# EAGLE design LEDCube (EAGLE 7.2.0)
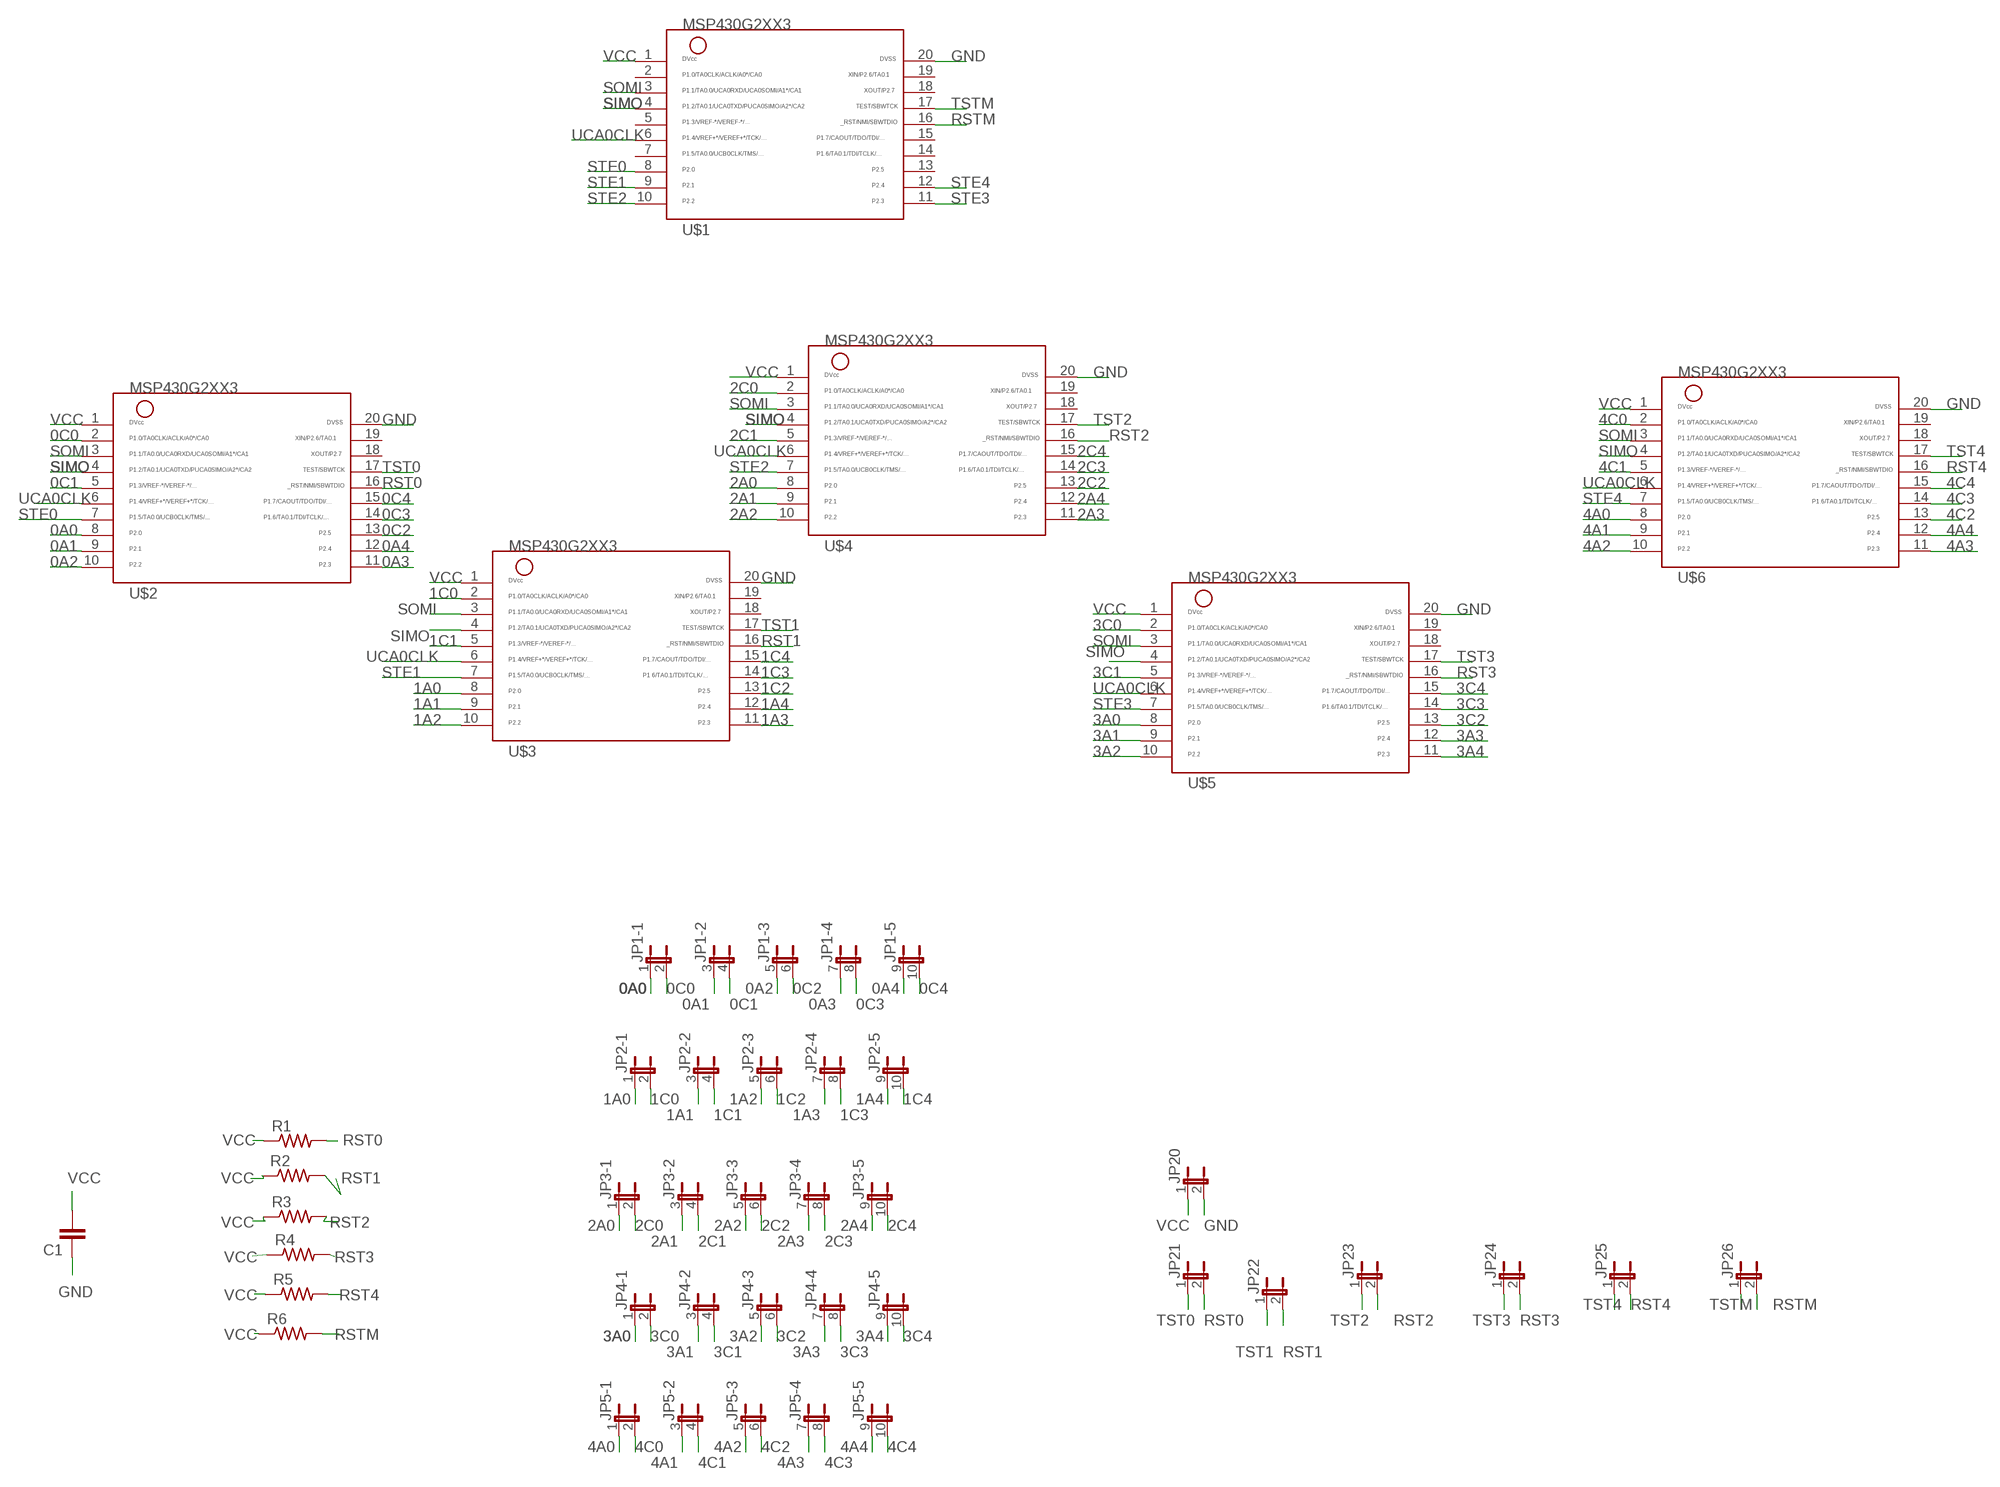
[diagram p0: schematic, sheet 1]

## Parts
C1  CC1206  [C1206]
JP1  JP5QE  [JP5Q]
JP2  JP5QE  [JP5Q]
JP3  JP5QE  [JP5Q]
JP4  JP5QE  [JP5Q]
JP5  JP5QE  [JP5Q]
JP20  JP1E  [JP1]
JP21  JP1E  [JP1]
JP22  JP1E  [JP1]
JP23  JP1E  [JP1]
JP24  JP1E  [JP1]
JP25  JP1E  [JP1]
JP26  JP1E  [JP1]
R1  R-US_R1206  [R1206]
R2  R-US_R1206  [R1206]
R3  R-US_R1206  [R1206]
R4  R-US_R1206  [R1206]
R5  R-US_R1206  [R1206]
R6  R-US_R1206  [R1206]
U$1  MSP430G2XX3TSSOP  [PW20]
U$2  MSP430G2XX3TSSOP  [PW20]
U$3  MSP430G2XX3TSSOP  [PW20]
U$4  MSP430G2XX3TSSOP  [PW20]
U$5  MSP430G2XX3TSSOP  [PW20]
U$6  MSP430G2XX3TSSOP  [PW20]

## Nets
0A0: JP1.1 U$2.8
0A1: JP1.3 U$2.9
0A2: JP1.5 U$2.10
0A3: JP1.7 U$2.11
0A4: JP1.9 U$2.12
0C0: JP1.2 U$2.2
0C1: JP1.4 U$2.5
0C2: JP1.6 U$2.13
0C3: JP1.8 U$2.14
0C4: JP1.10 U$2.15
1A0: JP2.1 U$3.8
1A1: JP2.3 U$3.9
1A2: JP2.5 U$3.10
1A3: JP2.7 U$3.11
1A4: JP2.9 U$3.12
1C0: JP2.2 U$3.2
1C1: JP2.4 U$3.5
1C2: JP2.6 U$3.13
1C3: JP2.8 U$3.14
1C4: JP2.10 U$3.15
2A0: JP3.1 U$4.8
2A1: JP3.3 U$4.9
2A2: JP3.5 U$4.10
2A3: JP3.7 U$4.11
2A4: JP3.9 U$4.12
2C0: JP3.2 U$4.2
2C1: JP3.4 U$4.5
2C2: JP3.6 U$4.13
2C3: JP3.8 U$4.14
2C4: JP3.10 U$4.15
3A0: JP4.1 U$5.8
3A1: JP4.3 U$5.9
3A2: JP4.5 U$5.10
3A3: JP4.7 U$5.12
3A4: JP4.9 U$5.11
3C0: JP4.2 U$5.2
3C1: JP4.4 U$5.5
3C2: JP4.6 U$5.13
3C3: JP4.8 U$5.14
3C4: JP4.10 U$5.15
4A0: JP5.1 U$6.8
4A1: JP5.3 U$6.9
4A2: JP5.5 U$6.10
4A3: JP5.7 U$6.11
4A4: JP5.9 U$6.12
4C0: JP5.2 U$6.2
4C1: JP5.4 U$6.5
4C2: JP5.6 U$6.13
4C3: JP5.8 U$6.14
4C4: JP5.10 U$6.15
GND: C1.1 JP20.2 U$1.20 U$2.20 U$3.20 U$4.20 U$5.20 U$6.20
RST0: JP21.2 R1.2 U$2.16
RST1: JP22.2 R2.2 U$3.16
RST2: JP23.2 R3.2 U$4.16
RST3: JP24.2 R4.2 U$5.16
RST4: JP25.2 R5.2 U$6.16
RSTM: JP26.2 R6.2 U$1.16
SIMO: U$1.4 U$2.4 U$3.4 U$4.4 U$5.4 U$6.4
SOMI: U$1.3 U$2.3 U$3.3 U$4.3 U$5.3 U$6.3
STE0: U$1.8 U$2.7
STE1: U$1.9 U$3.7
STE2: U$1.10 U$4.7
STE3: U$1.11 U$5.7
STE4: U$1.12 U$6.7
TST0: JP21.1 U$2.17
TST1: JP22.1 U$3.17
TST2: JP23.1 U$4.17
TST3: JP24.1 U$5.17
TST4: JP25.1 U$6.17
TSTM: JP26.1 U$1.17
UCA0CLK: U$1.6 U$2.6 U$3.6 U$4.6 U$5.6 U$6.6
VCC: C1.2 JP20.1 R1.1 R2.1 R3.1 R4.1 R5.1 R6.1 U$1.1 U$2.1 U$3.1 U$4.1 U$5.1 U$6.1
Unconnected: U$1.2 U$1.5 U$1.7 U$1.13 U$1.14 U$1.15 U$1.18 U$1.19 U$2.18 U$2.19 U$3.18 U$3.19 U$4.18 U$4.19 U$5.18 U$5.19 U$6.18 U$6.19

## Library data of the parts
C1 = eagle-ltspice:C: CAPACITOR, European symbol; SPICEMODEL: NONE; SPICEPREFIX: C
JP1-JP5 = jumper:JP5QE: JUMPER
JP20-JP26 = jumper:JP1E: JUMPER
R1-R6 = rcl:R-US_: RESISTOR, American symbol
U$1-U$6 = ELEC327:MSP430G2XX3: MSP430G2XX3 PDIP (N) 20 Pin Package

## Board
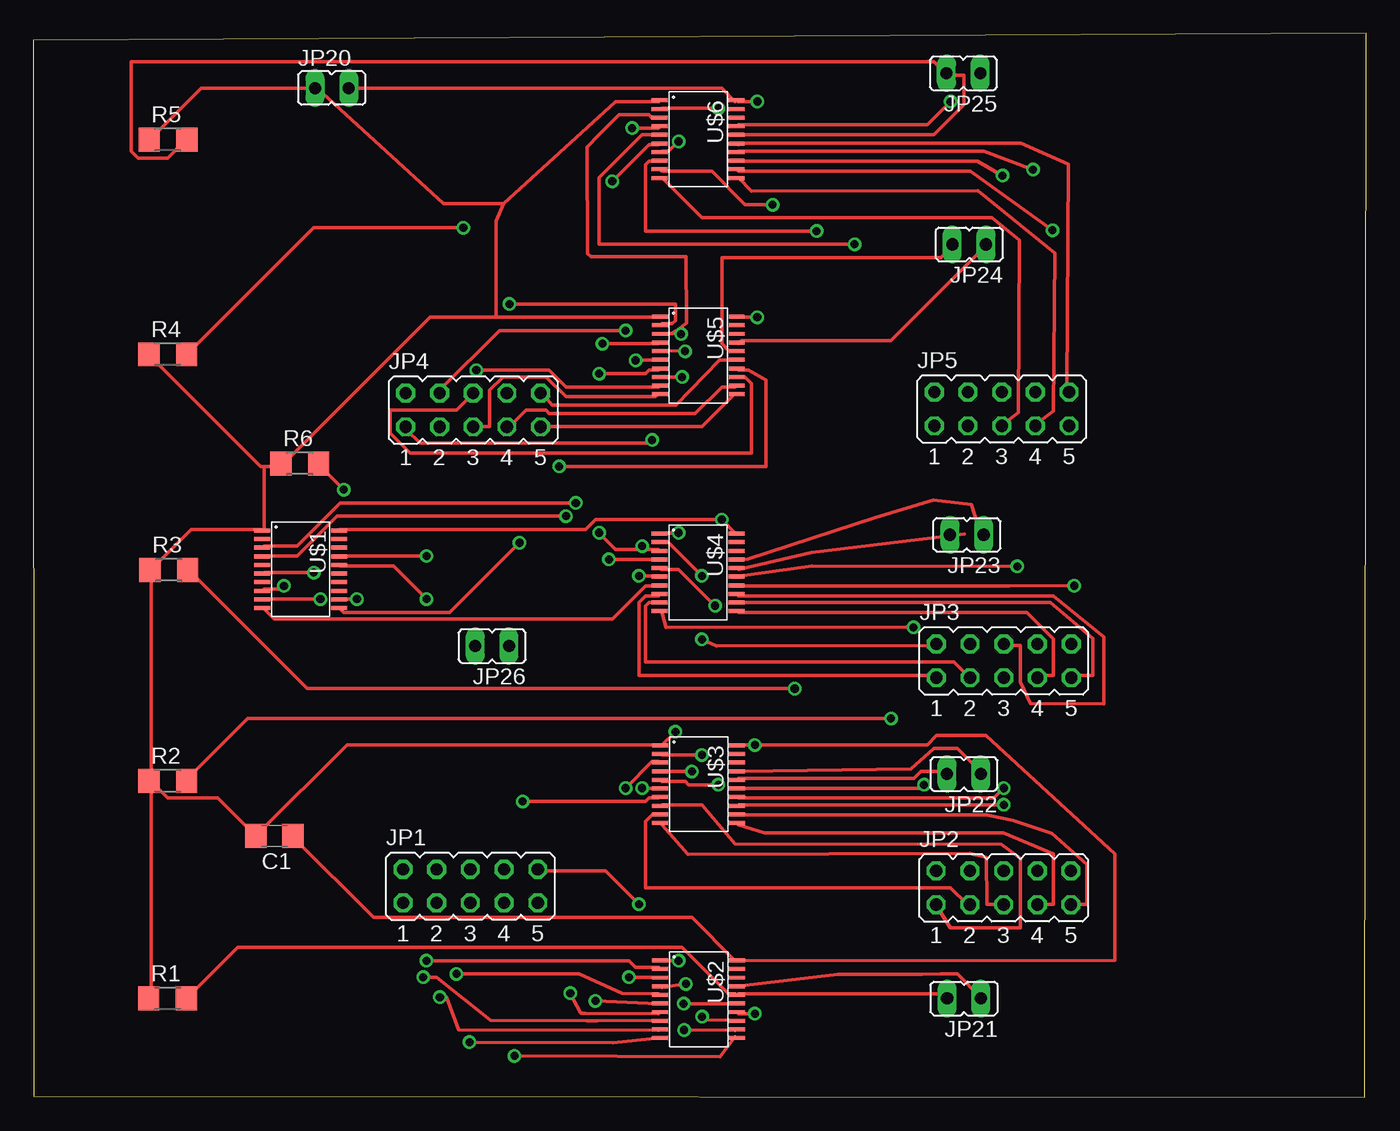
[diagram p1: board, top side]
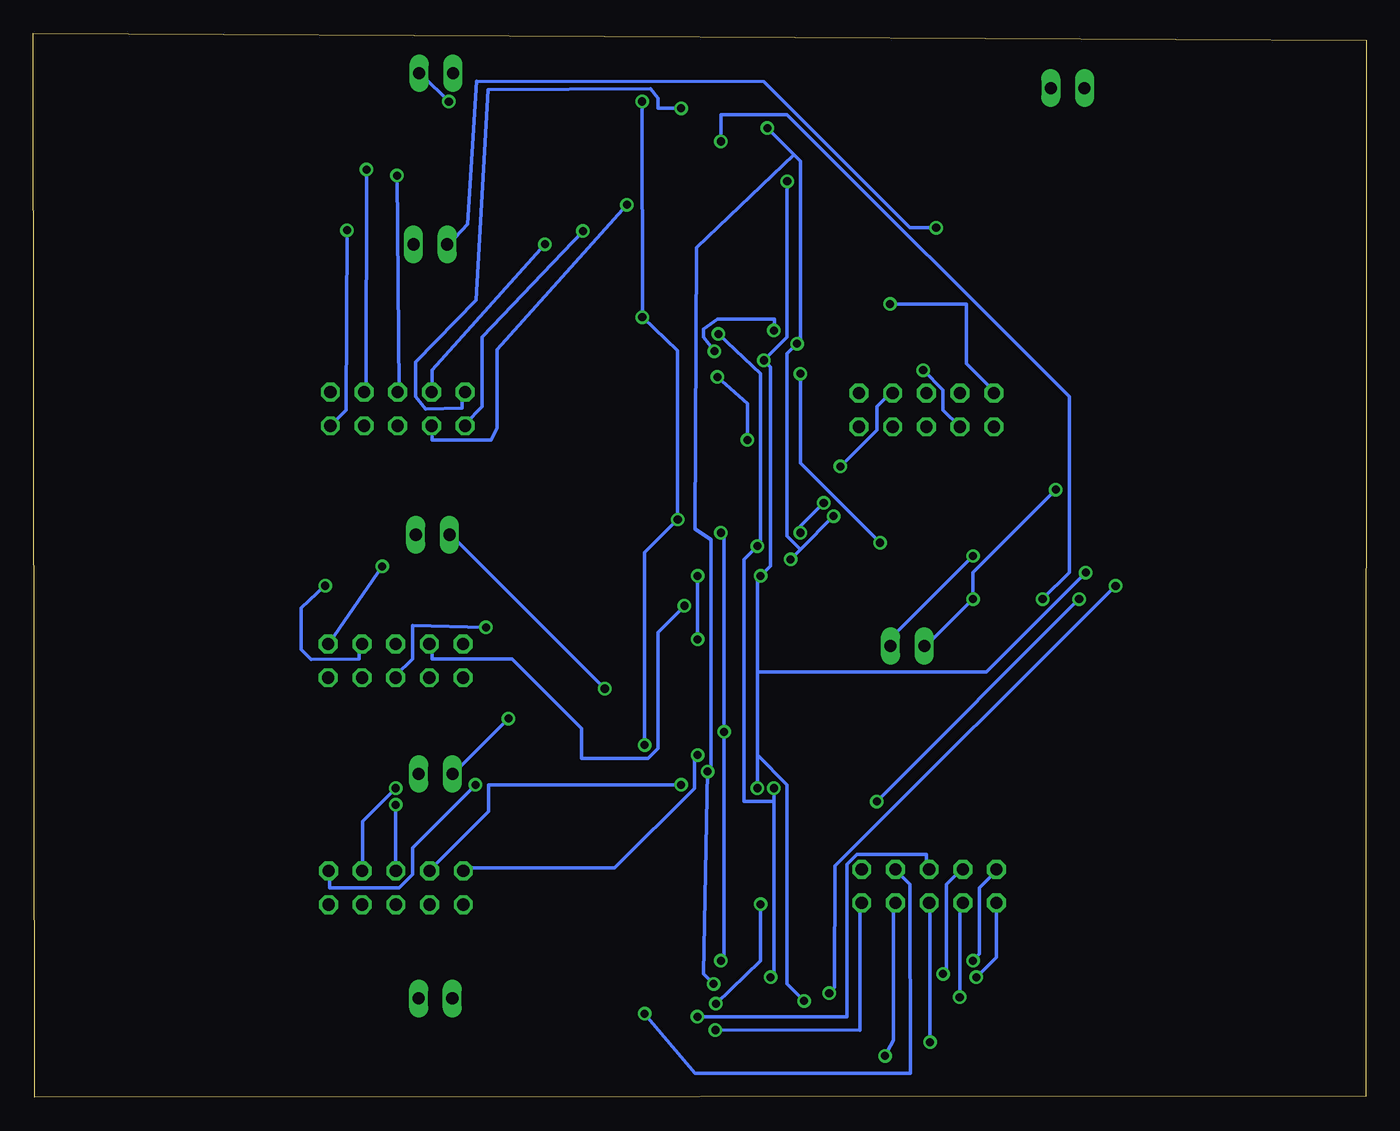
[diagram p2: board, bottom side, seen from below]

Size 100.48 x 80.22 mm. Coordinates in mm from the lower left corner, seen from the top.
Outline: 0.05,0.08 100.37,0 100.48,80.22 0,79.68 0.05,0.08
Copper layers (1*16): Top 0.035mm / dielectric 1.5mm / Bottom 0.035mm
Design rules "default": minimum track width 10mil, minimum drill 24mil, track to track 8mil, track to pad 8mil, pad to pad 8mil, via to via 8mil, smd to smd 8mil, copper to edge 40mil, drill to drill 8mil, minimum pad ring 10mil, minimum via ring 8mil, stop-mask expansion 4mil, vias tented up to drill 0mil, thermal gap 10mil

### Footprints (pad centres in the part's own frame; a part is rotated, then mirrored left to right if it is on the bottom)
C1206 = smd 1.6 x 1.8: 1 -1.4,0; 2 1.4,0
JP5Q = drill 0.914 octagon: 1 -5.08,-1.27; 2 -5.08,1.27; 3 -2.54,-1.27; 4 -2.54,1.27; 5 0,-1.27; 6 0,1.27; 7 2.54,-1.27; 8 2.54,1.27; 9 5.08,-1.27; 10 5.08,1.27
JP1 = drill 0.914 long: 1 0,-1.27; 2 0,1.27
R1206 = smd 1.6 x 1.803: 1 -1.422,0; 2 1.422,0
PW20 = smd 0.3 x 1.2: 1 -2.925,-2.9; 2 -2.275,-2.9; 3 -1.625,-2.9; 4 -0.975,-2.9; 5 -0.325,-2.9; 6 0.325,-2.9; 7 0.975,-2.9; 8 1.625,-2.9; 9 2.275,-2.9; 10 2.925,-2.9; 11 2.925,2.9; 12 2.275,2.9; 13 1.625,2.9; 14 0.975,2.9; 15 0.325,2.9; 16 -0.325,2.9; 17 -0.975,2.9; 18 -1.625,2.9; 19 -2.275,2.9; 20 -2.925,2.9

### Placement (x,y rotation side)
C1  18.18,19.72 180 top
JP1  32.95,15.93 0 top
JP2  73.14,15.8 0 top
JP3  73.16,32.91 0 top
JP4  33.16,51.82 0 top
JP5  73,51.89 0 top
JP20  22.51,76.08 270 top
JP21  70.16,7.46 90 top
JP22  70.15,24.39 90 top
JP23  70.37,42.41 90 top
JP24  70.55,64.3 90 top
JP25  70.11,77.2 90 top
JP26  34.59,34.03 90 top
R1  10.13,7.46 0 top
R2  10.14,23.86 0 top
R3  10.23,39.77 0 top
R4  10.15,56.01 0 top
R5  10.16,72.2 0 top
R6  20.1,47.79 0 top
U$1  20.16,39.81 270 top
U$2  50.15,7.41 270 top
U$3  50.15,23.61 270 top
U$4  50.11,39.58 270 top
U$5  50.13,55.93 270 top
U$6  50.12,72.23 270 top

### Tracks (layer width: path | path; a pad name or v marks a point on that pad's centre or on a via)
0A0  (via drill 0.61)
  Top 0.254: v29.4,9.06 30.4,9.06 34.49,5.83 41.69,5.76 42.52,5.76 47.15,5.81 U$2.8
  Bottom 0.254: v29.4,9.06 27.9,10.56 27.9,14.56 JP1.1
0A1  (via drill 0.61)
  Top 0.254: v30.65,7.56 31.15,7.56 32.05,5.08 47.15,5.06 U$2.9
  Bottom 0.254: v30.65,7.56 30.65,14.56 JP1.3
0A2  (via drill 0.61)
  Top 0.254: v32.88,4.16 43.71,4.13 U$2.10
  Bottom 0.254: v32.88,4.16 32.9,14.56 JP1.5
0A3  (via drill 0.61)
  Top 0.254: v36.27,3.13 51.76,3.06 52.9,4.56 U$2.11
  Bottom 0.254: v36.27,3.13 35.65,4.31 35.65,14.56 JP1.7
0A4  (via drill 0.61)
  Top 0.254: v49.06,5.08 52.9,5.06 U$2.12
  Bottom 0.254: v49.06,5.08 38.15,5.06 38.15,14.56 JP1.9
0C0  (via drill 0.61)
  Top 0.254: v29.65,10.31 44.9,10.31 45.4,9.81 47.15,9.81 U$2.2
  Bottom 0.254: v29.65,10.31 29.15,10.81 29.15,15.81 27.9,17.06 JP1.2
0C1  (via drill 0.61)
  Top 0.254: v31.9,9.31 41.15,9.31 44.37,7.86 47.15,7.81 U$2.5
  Bottom 0.254: v31.9,9.31 31.65,9.56 31.65,16.06 30.65,17.06 JP1.4
0C2  (via drill 0.61)
  Top 0.254: v50.42,6.09 50.9,5.85 52.9,5.81 U$2.13
  Bottom 0.254: v50.42,6.09 39.15,6.06 39.15,17.56 38.4,18.31 33.15,18.31 33.15,17.31 JP1.6
0C3  (via drill 0.61)
  Top 0.254: v54.4,6.31 53.15,6.31 U$2.14
  Bottom 0.254: v54.4,6.31 50.61,1.83 34.36,1.83 34.4,16.06 35.4,17.06 JP1.8
0C4  (via drill 0.61)
  Top 0.254: v49.03,7.06 52.9,7.06 U$2.15 | v45.65,14.56 43.15,17.06 38.15,17.06 JP1.10
  Bottom 0.254: v49.03,7.06 45.65,10.31 v45.65,14.56
1A0
  Top 0.254: U$3.8 47.4,22.06 50.4,22.06 52.91,19.1 72.98,19.07 74.4,18.02 74.4,12.8 69.15,12.8 68.15,14.31 JP2.1
1A1
  Top 0.254: U$3.9 47.15,21.31 46.65,21.31 46.15,20.81 46.15,15.81 69.15,15.81 70.4,14.56 JP2.3
1A2
  Top 0.254: U$3.10 47.4,20.56 49.36,18.31 70.61,18.39 71.86,18.08 71.9,14.56 72.9,14.56 JP2.5
1A3
  Top 0.254: U$3.11 53.15,20.56 55.12,19.94 73.12,19.93 76.9,18.34 76.9,14.56 75.9,14.56 JP2.7
1A4
  Top 0.254: U$3.12 53.15,21.31 71.86,21.31 73.85,20.89 76.77,19.89 79.4,17.56 79.4,14.56 78.4,14.56 JP2.9
1C0  (via drill 0.61)
  Top 0.254: v50.4,25.81 47.4,25.81 U$3.2
  Bottom 0.254: v50.4,25.81 50.65,25.56 50.65,23.31 56.65,17.31 67.9,17.31 JP2.2
1C1  (via drill 0.61)
  Top 0.254: v51.65,23.56 49.4,23.56 49.15,23.81 47.4,23.81 U$3.5
  Bottom 0.254: v51.65,23.56 66.15,23.56 66.15,21.56 70.4,17.31 JP2.4
1C2  (via drill 0.61)
  Top 0.254: v73.15,22.06 53.15,22.06 U$3.13
  Bottom 0.254: v73.15,22.06 73.15,17.31 JP2.6
1C3  (via drill 0.61)
  Top 0.254: v73.15,23.31 72.4,22.56 53.15,22.56 U$3.14
  Bottom 0.254: v73.15,23.31 75.65,20.81 75.65,17.31 JP2.8
1C4  (via drill 0.61)
  Top 0.254: v67.15,23.56 66.9,23.31 53.15,23.31 U$3.15
  Bottom 0.254: v67.15,23.56 71.9,18.81 71.9,16.81 72.9,15.81 78.15,15.81 78.15,17.06 JP2.10
2A0
  Top 0.254: U$4.8 47.15,37.81 46.15,37.81 45.65,37.31 45.65,31.81 67.9,31.81 JP3.1
2A1
  Top 0.254: U$4.9 47.15,37.31 46.4,37.31 46.15,37.06 46.15,32.81 69.4,32.81 70.4,31.81 JP3.3
2A2  (via drill 0.61)
  Top 0.254: v66.35,35.43 65.82,35.46 47.7,35.41 47.4,36.56 U$4.10
  Bottom 0.254: v66.35,35.43 71.9,35.56 71.9,33.06 73.15,31.81 JP3.5
2A3
  Top 0.254: U$4.11 53.15,36.56 74.9,36.56 76.9,34.56 76.9,31.81 75.9,31.81 JP3.7
2A4
  Top 0.254: U$4.12 53.15,37.31 76.65,37.31 79.88,34.58 79.87,31.81 78.4,31.81 JP3.9
2C0  (via drill 0.61)
  Top 0.254: v50.4,39.31 47.9,41.81 47.4,41.81 U$4.2 | v50.4,34.53 51.49,34.02 67.51,34.05 JP3.2
  Bottom 0.254: v50.4,34.53 v50.4,39.31
2C1  (via drill 0.61)
  Top 0.254: v51.4,37.06 48.65,39.81 47.4,39.81 U$4.5
  Bottom 0.254: v51.4,37.06 53.4,35.06 53.4,26.31 54.15,25.56 59.15,25.56 59.15,27.81 64.4,33.06 70.4,33.06 70.4,34.06 JP3.4
2C2
  Top 0.254: U$4.13 53.15,37.81 76.9,37.81 80.69,34.72 80.69,29.67 75.15,29.69 74.4,31.31 74.4,34.06 73.4,34.06 JP3.6
2C3  (via drill 0.61)
  Top 0.254: v78.47,38.57 73.54,38.54 72.25,38.56 53.15,38.56 U$4.14
  Bottom 0.254: v78.47,38.57 80.29,36.88 80.29,33.76 79.54,33.01 75.9,33.06 75.9,34.06 JP3.8
2C4  (via drill 0.61)
  Top 0.254: v74.17,40.03 58.69,40.04 U$4.15
  Bottom 0.254: v74.17,40.03 78.15,34.31 JP3.10
3A0  (via drill 0.61)
  Top 0.254: v48.91,54.31 47.4,54.31 U$5.8 | v46.65,49.56 46.4,49.31 29.15,49.31 28.15,50.31 JP4.1
  Bottom 0.254: v48.91,54.31 46.65,52.31 v46.65,49.56
3A1  (via drill 0.61)
  Top 0.254: v33.4,54.81 38.9,54.81 40.15,53.56 47.15,53.56 U$5.9
  Bottom 0.254: v33.4,54.81 31.9,53.31 31.9,51.81 30.65,50.56 JP4.3
3A2
  Top 0.254: U$5.10 47.15,53.06 46.9,52.81 40.15,52.81 38.65,54.31 35.4,54.31 34.4,53.31 34.4,50.56 33.4,50.56 JP4.5
3A3
  Top 0.254: U$5.12 52.9,53.56 51.9,53.56 49.9,51.56 38.9,51.56 38.65,51.81 37.15,51.81 35.9,50.56 JP4.7
3A4
  Top 0.254: U$5.11 52.9,53.06 50.4,50.56 38.4,50.56 JP4.9
3C0  (via drill 0.61)
  Top 0.254: v35.9,59.81 48.4,59.81 48.4,58.56 48.15,58.31 47.4,58.31 U$5.2
  Bottom 0.254: v35.9,59.81 30.15,59.81 30.15,55.31 28.15,53.31 JP4.2
3C1  (via drill 0.61)
  Top 0.254: v49.14,56.25 47.4,56.31 U$5.5 | v44.65,57.81 35.15,57.81 30.65,53.31 JP4.4
  Bottom 0.254: v49.14,56.25 49.96,57.32 49.96,57.93 48.9,58.67 44.62,58.67 v44.65,57.81
3C2
  Top 0.254: U$5.13 53.15,54.31 53.65,54.31 54.15,53.81 54.15,48.56 28.4,48.56 26.9,50.06 26.9,51.81 31.9,51.81 33.15,53.06 JP4.6
3C3  (via drill 0.61)
  Top 0.254: v39.65,47.56 55.25,47.56 55.25,54.06 53.9,54.81 53.15,54.81 U$5.14
  Bottom 0.254: v39.65,47.56 36.9,50.31 36.9,52.06 35.9,53.06 JP4.8
3C4
  Top 0.254: U$5.15 52.9,55.56 51.74,55.57 48.45,52.2 39.11,52.19 38.4,53.06 JP4.10
4A0  (via drill 0.61)
  Top 0.254: v59.05,65.31 46.15,65.31 46.15,70.31 46.4,70.56 47.15,70.56 U$6.8
  Bottom 0.254: v59.05,65.31 66.65,57.31 66.65,52.06 67.9,50.81 JP5.1
4A1  (via drill 0.61)
  Top 0.254: v55.73,67.29 53.65,67.31 51.15,69.81 47.4,69.81 U$6.9
  Bottom 0.254: v55.73,67.29 65.52,56.36 65.52,50.46 65.98,49.56 70.4,49.56 70.4,50.56 JP5.3
4A2
  Top 0.254: U$6.10 47.4,69.31 50.4,66.31 72.27,66.31 74.32,64.61 74.27,51.63 73.15,50.81 JP5.5
4A3
  Top 0.254: U$6.11 53.15,69.31 54.15,68.31 71.19,68.35 76.99,63.64 76.88,51.72 75.65,50.81 JP5.7
4A4  (via drill 0.61)
  Top 0.254: v76.83,65.37 70.65,69.81 53.15,69.81 U$6.12
  Bottom 0.254: v76.83,65.37 76.9,51.81 77.9,50.81 JP5.9
4C0  (via drill 0.61)
  Top 0.254: v51.65,74.56 47.4,74.56 U$6.2
  Bottom 0.254: v51.65,74.56 53.4,74.56 53.4,75.31 53.94,76.02 66.2,75.95 67.09,60.09 71.67,55.41 71.65,52.81 70.9,51.88 68.15,51.95 68.15,53.06 JP5.2
4C1  (via drill 0.61)
  Top 0.254: v61.9,64.31 42.65,64.31 42.65,69.31 45.9,72.56 47.15,72.56 U$6.5
  Bottom 0.254: v61.9,64.31 70.4,54.81 70.4,53.31 JP5.4
4C2  (via drill 0.61)
  Top 0.254: v73.06,69.48 71.15,70.56 53.15,70.56 U$6.13
  Bottom 0.254: v73.06,69.48 72.9,53.31 JP5.6
4C3  (via drill 0.61)
  Top 0.254: v75.36,69.94 71.65,71.31 53.15,71.31 U$6.14
  Bottom 0.254: v75.36,69.94 75.4,53.31 JP5.8
4C4
  Top 0.254: U$6.15 53.15,71.81 53.43,71.93 74.43,71.93 78.03,70.33 77.9,53.31 JP5.10
GND  (via drill 0.61)
  Top 0.254: JP20.2 23.9,76.06 51.9,76.06 52.9,75.06 U$6.20 53.15,75.06 v54.58,75.07 | U$1.20 23.15,42.81 41.65,42.81 42.4,43.56 v51.9,43.56 52.9,42.56 U$4.20 | v54.57,58.81 53.15,58.81 U$5.20 | C1.1 19.65,19.56 25.65,13.56 49.65,13.56 52.9,10.31 U$2.20 53.15,10.31 81.54,10.35 81.54,18.35 71.82,27.27 68.07,27.27 67.4,26.56 v54.4,26.56 53.15,26.56 U$3.20
  Bottom 0.254: v54.58,75.07 v54.57,58.81 51.9,56.31 v51.9,43.56 54.4,41.06 v54.4,26.56
RST0
  Top 0.254: JP21.2 68.65,7.56 68.4,7.81 53.15,7.81 U$2.16 52.9,7.81 52.4,7.81 48.9,11.31 15.4,11.31 11.65,7.56 R1.2
RST1  (via drill 0.61)
  Top 0.254: U$3.16 53.15,24.06 66.4,24.06 66.9,24.56 68.65,24.56 JP22.2 | v64.65,28.56 16.15,28.56 11.65,24.06 R2.2
  Bottom 0.254: v64.65,28.56 68.65,24.56 JP22.2
RST2  (via drill 0.61)
  Top 0.254: U$4.16 53.15,39.81 58.67,41.06 70.19,42.45 68.9,42.31 JP23.2 | v57.4,30.81 20.65,30.81 11.9,39.56 R3.2
  Bottom 0.254: v57.4,30.81 68.9,42.31 JP23.2
RST3  (via drill 0.61)
  Top 0.254: U$5.16 52.9,56.31 52.4,56.31 51.9,56.81 51.9,63.31 68.4,63.31 69.15,64.06 JP24.2 | v32.42,65.56 21.15,65.56 11.65,56.06 R4.2
  Bottom 0.254: v32.42,65.56 34.4,65.56 45.4,76.56 67.07,76.58 67.75,65.84 69.15,64.31 JP24.2
RST4
  Top 0.254: U$6.16 53.15,72.56 67.9,72.56 70.15,74.81 70.15,77.06 68.9,77.06 JP25.2 68.65,77.31 67.9,78.06 7.4,78.06 7.4,71.31 7.9,70.81 10.15,70.81 11.4,72.06 R5.2
RSTM  (via drill 0.61)
  Top 0.254: v29.65,37.56 27.15,40.06 23.15,40.06 U$1.16 | v23.4,45.81 21.65,47.56 R6.2
  Bottom 0.254: JP26.2 33.15,34.06 v29.65,37.56 29.65,39.56 v23.4,45.81
SIMO  (via drill 0.61)
  Top 0.254: v49.2,8.55 47.4,8.31 U$2.4 | v49.65,24.56 47.4,24.56 U$3.4 | v40.15,43.81 22.9,43.81 19.9,40.81 17.4,40.81 U$1.4 | v43.4,40.56 47.15,40.56 U$4.4 | v42.9,56.81 47.15,56.81 U$5.4 | v45.15,73.06 47.15,73.06 U$6.4
  Bottom 0.254: v49.2,8.55 49.95,9.3 v49.65,24.56 49.4,24.81 49.4,42.06 50.61,42.86 50.5,64.06 43.15,71.06 | v43.4,40.56 42.65,41.31 | 42.65,41.31 v40.15,43.81 | 42.65,41.31 43.65,42.31 43.65,56.06 v42.9,56.81 42.65,57.06 42.65,70.56 43.15,71.06 | 43.15,71.06 v45.15,73.06
SOMI  (via drill 0.61)
  Top 0.254: 48.44,57.77 49.24,58.35 49.21,63.37 42.03,63.37 41.78,63.62 41.74,71.64 42.65,72.56 44.15,74.06 46.4,74.06 46.65,73.81 47.15,73.81 U$6.3 | 48.44,57.77 48.15,57.56 47.4,57.56 U$5.3 | v44.9,9.06 47.15,9.06 U$2.3 | v44.65,23.31 46.65,25.31 47.15,25.31 U$3.3 | v40.9,44.81 23.15,44.81 19.9,41.56 17.4,41.56 U$1.3 | v42.65,42.56 43.9,41.31 45.9,41.31 | 45.9,41.31 47.15,41.31 U$4.3 | 45.9,41.31 v45.9,41.56 | v48.83,57.54 48.44,57.77
  Bottom 0.254: v44.9,9.06 44.65,9.31 44.65,22.31 | v44.65,23.31 44.65,22.31 | v40.9,44.81 42.65,43.06 v42.65,42.56 | 44.65,22.31 46.9,22.31 46.9,40.56 v45.9,41.56 45.65,41.81 45.65,54.56 v48.83,57.54
STE0  (via drill 0.61)
  Top 0.254: v40.48,7.85 41.24,6.37 41.31,6.36 41.59,6.34 47.15,6.31 U$2.7 | v18.9,38.56 18.65,38.31 17.4,38.31 U$1.8
  Bottom 0.254: v40.48,7.85 40.07,8.31 40.04,17.47 v18.9,38.56
STE1  (via drill 0.61)
  Top 0.254: v21.65,37.56 17.4,37.56 U$1.9 | v36.9,22.31 46.15,22.31 46.4,22.56 47.15,22.56 U$3.7
  Bottom 0.254: v36.9,22.31 v21.65,37.56
STE2
  Top 0.254: U$1.10 17.4,36.81 18.15,36.06 43.65,36.06 46.15,38.56 47.15,38.56 U$4.7
STE3  (via drill 0.61)
  Top 0.254: v36.65,41.81 31.4,36.56 23.4,36.56 23.15,36.81 U$1.11 | v42.65,54.56 46.15,54.56 46.4,54.81 47.15,54.81 U$5.7
  Bottom 0.254: v36.65,41.81 42.65,47.81 v42.65,54.56
STE4  (via drill 0.61)
  Top 0.254: v24.4,37.56 23.15,37.56 U$1.12 | v48.65,72.06 47.9,71.31 47.4,71.31 U$6.7
  Bottom 0.254: v24.4,37.56 22.4,39.56 22.4,52.81 43.65,74.06 48.65,74.06 v48.65,72.06
TST0
  Top 0.254: U$2.17 60.65,9.29 67,9.28 68.4,9.31 69.65,9.31 71.4,7.56 JP21.1
TST1
  Top 0.254: U$3.17 53.15,24.56 66.15,24.76 67.9,26.31 69.65,26.31 71.4,24.56 JP22.1
TST2
  Top 0.254: U$4.17 53.87,40.6 63.5,43.73 67.86,45.02 70.72,44.68 71.4,42.56 JP23.1
TST3
  Top 0.254: U$5.17 53.15,56.81 53.4,57.06 64.65,57.06 71.65,64.06 JP24.1
TST4  (via drill 0.61)
  Top 0.254: v69.15,75.06 67.4,73.31 53.15,73.31 U$6.17
  Bottom 0.254: v69.15,75.06 71.15,77.06 JP25.1
TSTM  (via drill 0.61)
  Top 0.254: v29.65,40.81 23.15,40.81 U$1.17
  Bottom 0.254: v29.65,40.81 35.65,34.81 35.65,34.06 JP26.1
UCA0CLK  (via drill 0.61)
  Top 0.254: v45.65,39.31 47.15,39.31 U$4.6 | v45.9,23.31 47.15,23.31 U$3.6 | v21.15,39.56 17.4,39.56 U$1.6 | v45.4,55.56 47.15,55.56 U$5.6 | v43.65,69.06 46.4,71.81 47.15,71.81 U$6.6 | v42.38,7.27 47.15,7.06 U$2.6
  Bottom 0.254: v45.9,23.31 45.9,25.81 | 45.9,25.81 45.9,32.06 | 45.9,32.06 45.9,39.06 v45.65,39.31 44.9,40.06 44.9,55.06 v45.4,55.56 43.65,57.31 v43.65,69.06 | v21.15,39.56 28.65,32.06 45.9,32.06 | v42.38,7.27 43.65,8.56 43.65,23.56 45.9,25.81
VCC  (via drill 0.61)
  Top 0.254: v48.65,42.56 47.4,42.56 U$4.1 | v48.4,27.56 47.4,26.56 U$3.1 47.15,26.56 23.65,26.56 16.9,19.81 C1.2 16.65,19.81 13.9,22.56 10.15,22.56 8.9,23.81 | v48.65,10.31 47.4,10.31 U$2.1 | 8.9,23.81 8.9,7.56 R1.1 | 8.9,23.81 R2.1 8.9,24.06 8.9,39.56 R3.1 8.9,39.81 11.9,42.81 17.15,42.81 U$1.1 17.4,42.81 17.4,47.56 | R5.1 8.9,72.31 12.65,76.06 21.15,76.06 JP20.1 21.4,76.06 30.95,67.36 35.45,67.36 | 17.4,47.56 18.65,47.56 R6.1 18.9,47.81 29.9,58.81 34.9,58.81 | 34.9,58.81 47.15,58.81 U$5.1 | 35.45,67.36 34.9,66.06 34.9,58.81 | 35.45,67.36 43.9,75.06 47.15,75.06 U$6.1 | 17.4,47.56 17.15,47.56 8.9,55.81 R4.1
  Bottom 0.254: v48.65,42.56 48.4,42.31 v48.4,27.56 48.4,10.56 v48.65,10.31